# EAGLE design Zio Qwiic Capacitive Touch Sensor AT42QT2120 (EAGLE 9.3.1)
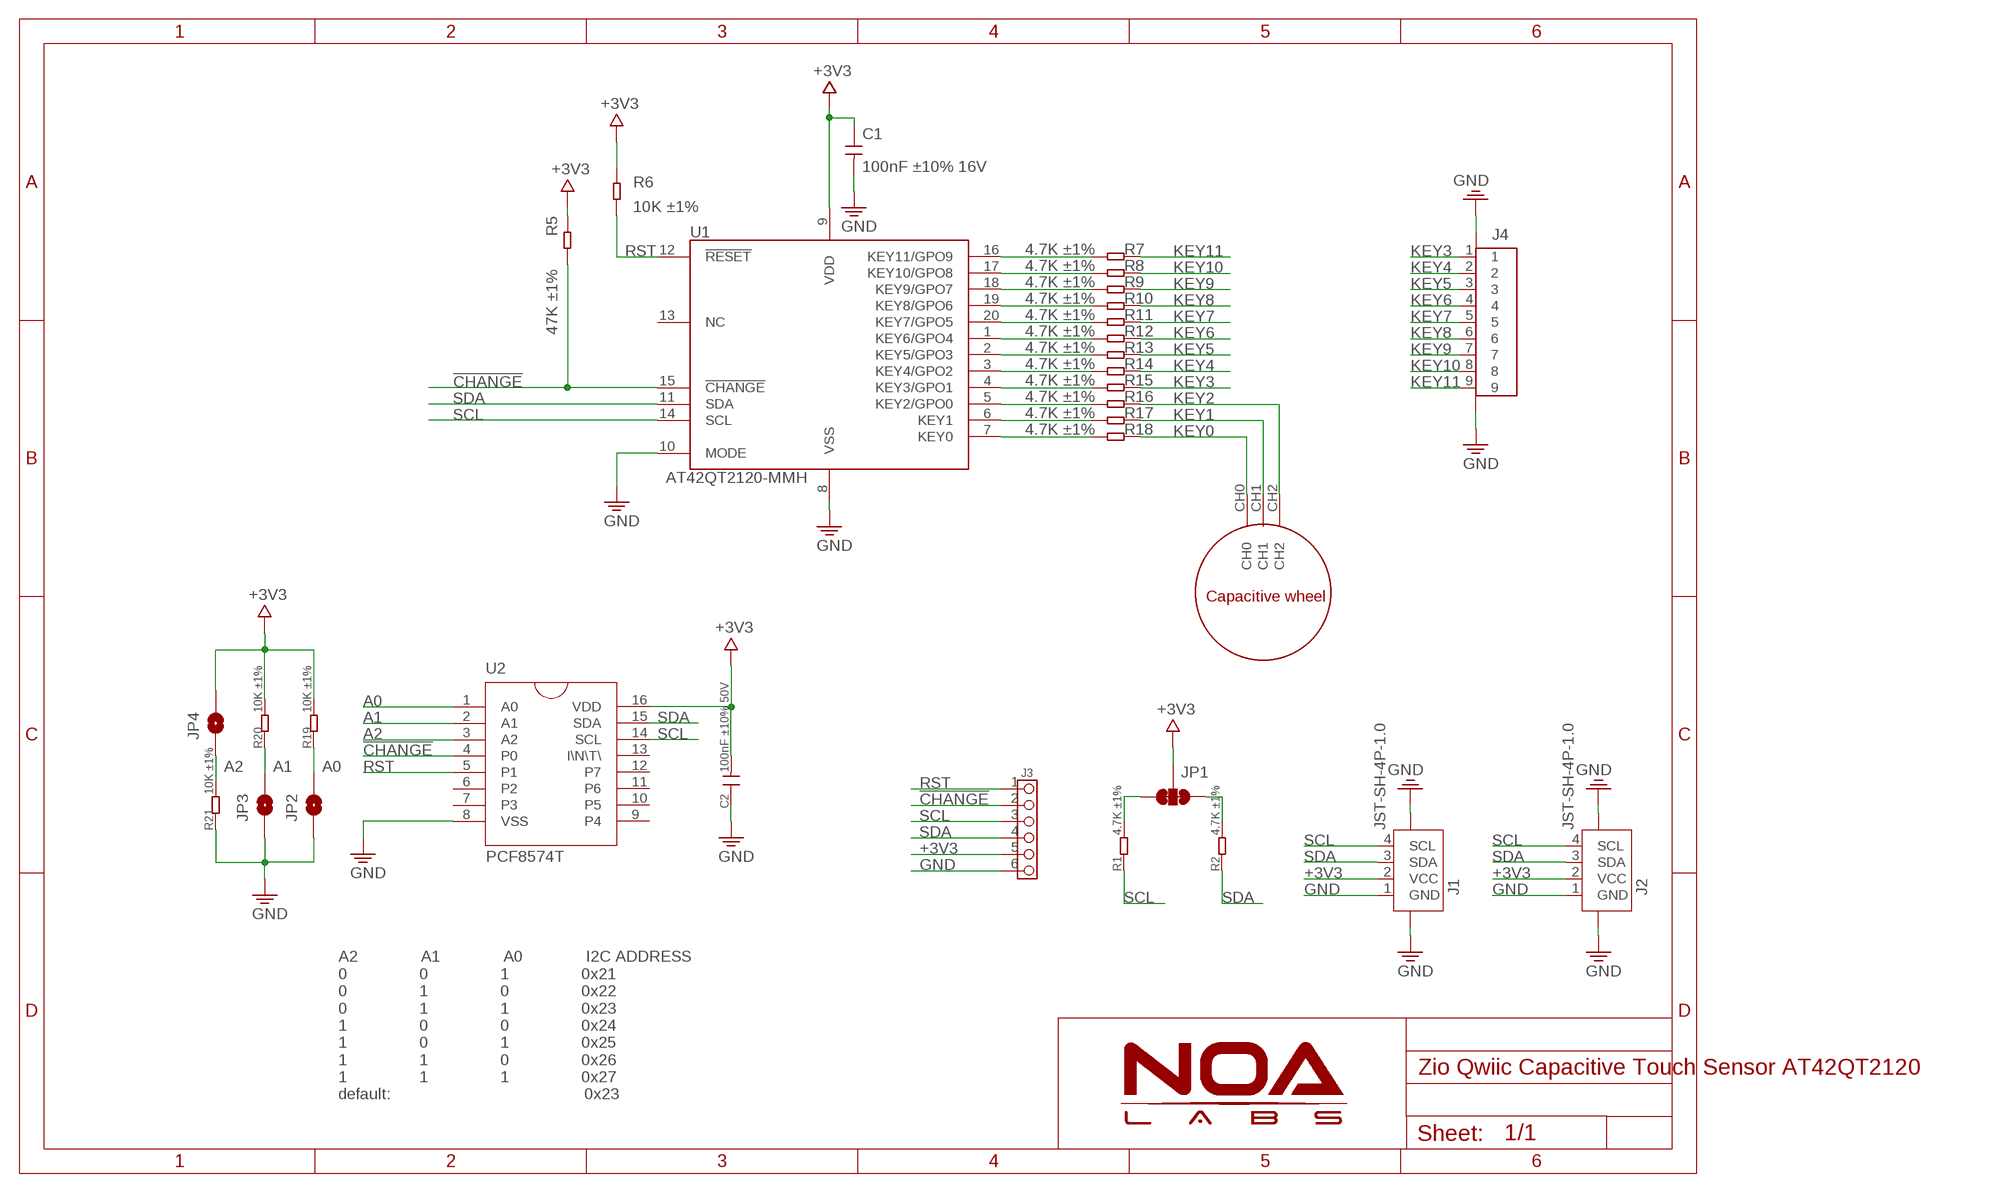
[diagram p0: schematic, sheet 1]

## Parts
C1  100nF ±10% 16V  C-0603  [C0603]
C2  100nF ±10% 50V  C-0603  [C0603]
J1  JST-SH-4P-1.0  [JST-SH-4P]
J2  JST-SH-4P-1.0  [JST-SH-4P]
J3  HEADER-6P-60/35MIL  [6P-2.54-60/35MIL]
J4  FPC-0.5-9P  [FPC-0.5-9P_UP]
JP1  SMT-JUMPER_3_2-NC_TRACE  [SMT-JUMPER_3_2-NC_TRACE]
JP2  JUMPER-SMT_2_NC_PASTE_NOCREM  [SMT-JUMPER_2_NC_PASTE_SILK_NOCREM]
JP3  JUMPER-SMT_2_NC_PASTE_NOCREM  [SMT-JUMPER_2_NC_PASTE_SILK_NOCREM]
JP4  JUMPER-SMT_2_NC_PASTE_NOCREM  [SMT-JUMPER_2_NC_PASTE_SILK_NOCREM]
R1  4.7K ±1%  R-0603  [R0603]
R2  4.7K ±1%  R-0603  [R0603]
R5  47K ±1%  R-0603  [R0603]
R6  10K ±1%  R-0603  [R0603]
R7  4.7K ±1%  R-0402  [R0402]
R8  4.7K ±1%  R-0402  [R0402]
R9  4.7K ±1%  R-0402  [R0402]
R10  4.7K ±1%  R-0402  [R0402]
R11  4.7K ±1%  R-0402  [R0402]
R12  4.7K ±1%  R-0402  [R0402]
R13  4.7K ±1%  R-0402  [R0402]
R14  4.7K ±1%  R-0402  [R0402]
R15  4.7K ±1%  R-0402  [R0402]
R16  4.7K ±1%  R-0402  [R0402]
R17  4.7K ±1%  R-0402  [R0402]
R18  4.7K ±1%  R-0402  [R0402]
R19  10K ±1%  R-0603  [R0603]
R20  10K ±1%  R-0603  [R0603]
R21  10K ±1%  R-0603  [R0603]
U1  AT42QT2120-MMH  AT42QT2120-COMMS-20M2  [QFN45P300X300X85-21N]
U2  PCF8574T  [SO16-W]
U3  QTWHEEL_MODULE  [QTWHEELMODULE]

## Nets
!CHANGE: J3.2 R5.1 U1.15(!CHANGE) U2.4(P0)
+3V3: C1.1 C2.2 J1.2(VCC) J2.2(VCC) J3.5 JP1.2 JP4.2 R5.2 R6.2 R19.2 R20.2 U1.9(VDD) U2.16(VDD)
A0: JP2.2 R19.1 U2.1(A0)
A1: JP3.2 R20.1 U2.2(A1)
A2: JP4.1 R21.2 U2.3(A2)
GND: C1.2 C2.1 J1.1(GND) J1.NC1 J1.NC2 J2.1(GND) J2.NC1 J2.NC2 J3.6 J4.11(G2) JP2.1 JP3.1 R21.1 U1.8(VSS) U1.10(MODE) U2.8(VSS)
KEY0: R18.1 U3.CH0
KEY1: R17.1 U3.CH1
KEY2: R16.1 U3.CH2
KEY3: J4.1 R15.1
KEY4: J4.2 R14.1
KEY5: J4.3 R13.1
KEY6: J4.4 R12.1
KEY7: J4.5 R11.1
KEY8: J4.6 R10.1
KEY9: J4.7 R9.1
KEY10: J4.8 R8.1
KEY11: J4.9 R7.1
N$1: JP1.1 R2.2
N$3: J4.10(G1) ; supply symbol labelled GND
N$6: JP1.3 R1.2
N$199: R7.2 U1.16(KEY11/GPO9)
N$216: R8.2 U1.17(KEY10/GPO8)
N$217: R9.2 U1.18(KEY9/GPO7)
N$218: R10.2 U1.19(KEY8/GPO6)
N$220: R11.2 U1.20(KEY7/GPO5)
N$221: R12.2 U1.1(KEY6/GPO4)
N$222: R13.2 U1.2(KEY5/GPO3)
N$238: R14.2 U1.3(KEY4/GPO2)
N$239: R15.2 U1.4(KEY3/GPO1)
N$240: R16.2 U1.5(KEY2/GPO0)
N$243: R17.2 U1.6(KEY1)
N$250: R18.2 U1.7(KEY0)
RST: J3.1 R6.1 U1.12(!RESET) U2.5(P1)
SCL: J1.4(SCL) J2.4(SCL) J3.3 R1.1 U1.14(SCL) U2.14(SCL)
SDA: J1.3(SDA) J2.3(SDA) J3.4 R2.1 U1.11(SDA) U2.15(SDA)
Unconnected: U1.13(NC) U2.6(P2) U2.7(P3) U2.9(P4) U2.10(P5) U2.11(P6) U2.12(P7) U2.13(I\N\T\)

## Notes on the sheet
- A2              A1              A0              I2C ADDRESS
  0                0                1                0x21
  0                1                0                0x22
  0                1                1                0x23
  1                0                0                0x24
  1                0                1                0x25
  1                1                0                0x26
  1                1                1                0x27
  default:                                           0x23

## Library data of the parts
C1 = RCL:C; VOLTAGE: 25V
C2 = RCL:C
J1 J2 = Connector:JST-SH-4P
J3 = Connector_NOA:HEADER-6P
J4 = Connector:FPC-0.5-9P
JP1 = NOA-Jumpers:SMT-JUMPER_3_2-NC_TRACE
JP2-JP4 = NOA-Jumpers:JUMPER-SMT_2_NC_PASTE_NOCREM
R1 R2 R5-R21 = RCL:R
U1 = IC:AT42QT2120-COMMS: Capacitive Touch Sensors 12 channel AT42QT2120-XU, Spread-Spectrum Charge-Transfer Touch Screen Controller Serial-I2C, 20-Pin TSSOP Source: Datasheet <http://docs-emea.rs-online.com/webdocs/1441/0900766b81441bc2.pdf>
U2 = IC:PCF8574T
U3 = Module:QTWHEEL_MODULE

## Board
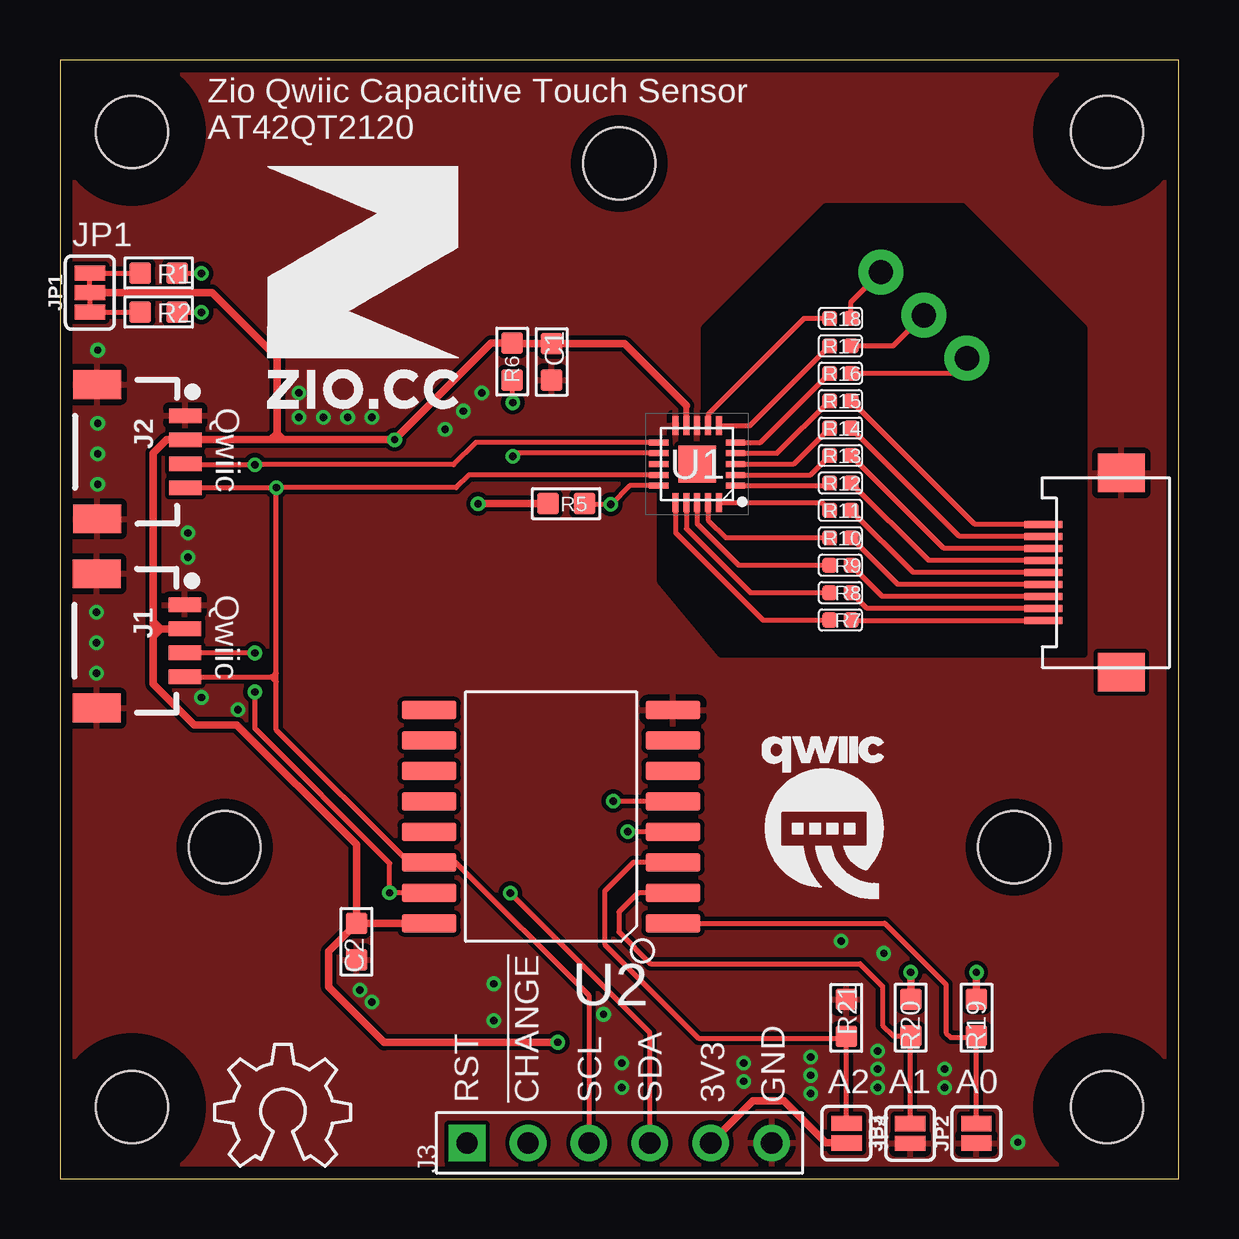
[diagram p1: board, top side]
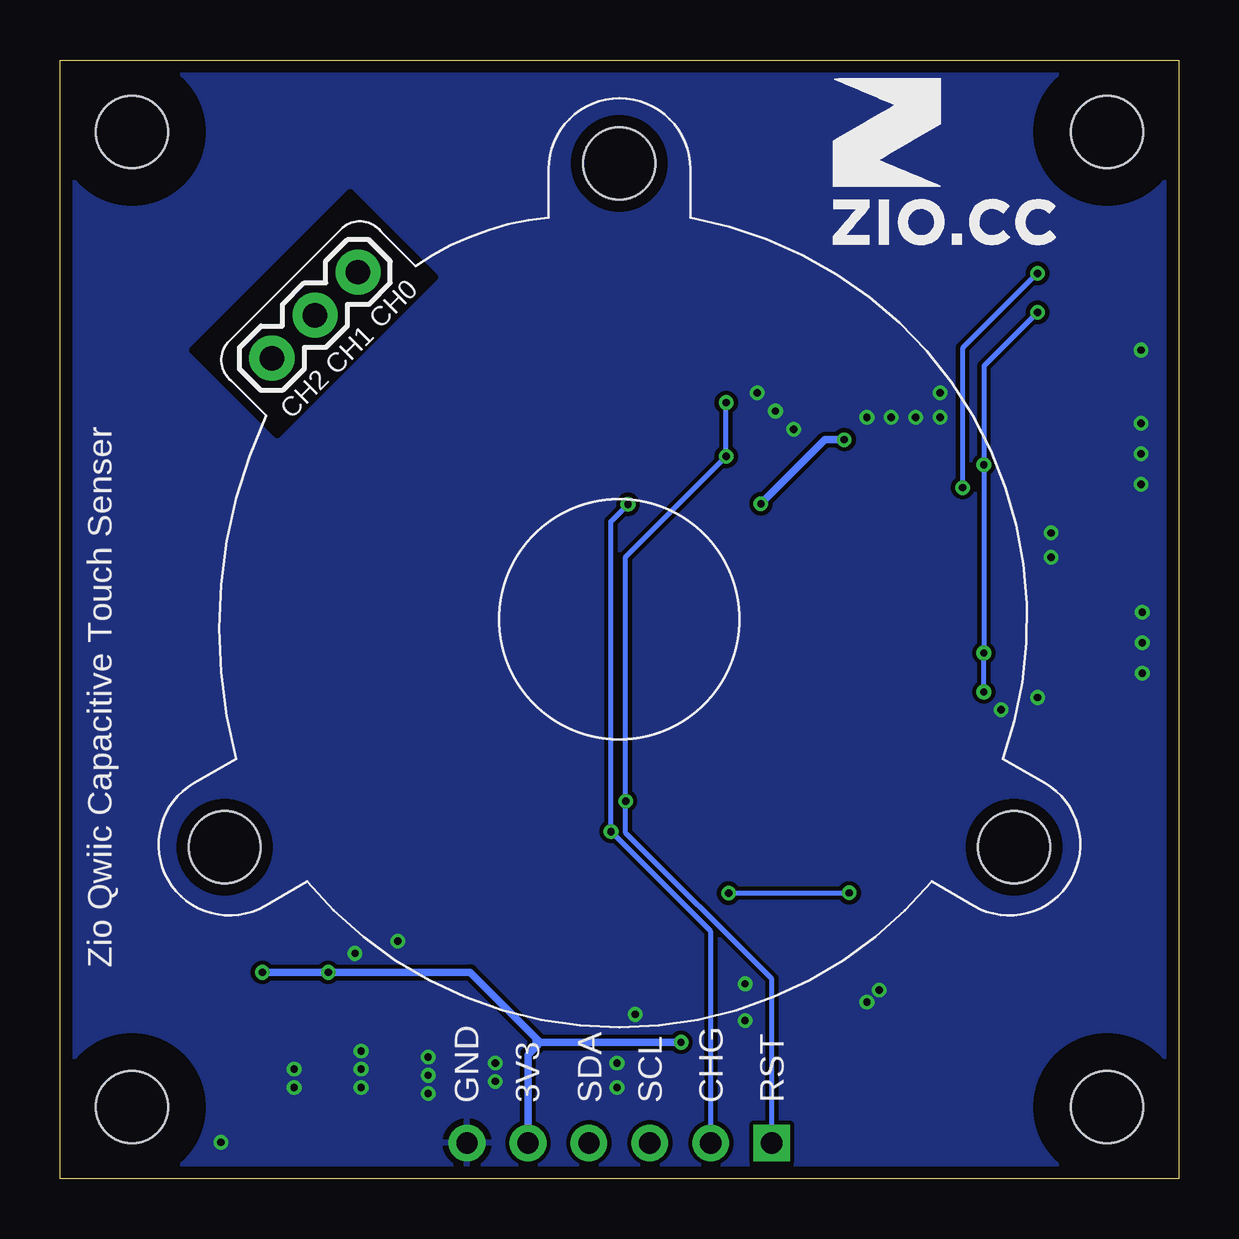
[diagram p2: board, bottom side, seen from below]

Size 46.64 x 46.64 mm. Coordinates in mm from the lower left corner, seen from the top.
Outline: 0,0 46.64,0 46.64,46.64 0,46.64 0,0
Copper layers (1*16): Top 0.035mm / dielectric 1.5mm / Bottom 0.035mm
Design rules "NOA Eagle Rule": minimum track width 7mil, minimum drill 12mil, track to track 7mil, track to pad 7mil, pad to pad 7mil, via to via 7mil, smd to smd 0mil, copper to edge 20mil, drill to drill 10mil, minimum pad ring 10mil, minimum via ring 6mil, stop-mask expansion 2mil, vias tented up to drill 25mil, thermal gap 10mil
Holes 3 mm at 3,3 43.64,3 43.64,43.64 3,43.64
tRestrict: area 0,0 to 6,6; area 40.6,0 to 46.6,6; area 0,40.6 to 6,46.6; area 40.6,40.6 to 46.6,46.6; 9 lines
bRestrict: area 0,40.6 to 6,46.6; area 40.6,40.6 to 46.6,46.6; area 0,0 to 6,6; area 40.6,0 to 46.6,6; 4 lines

### Footprints (pad centres in the part's own frame; a part is rotated, then mirrored left to right if it is on the bottom)
C0603 = smd 0.889 x 0.889: 1 -0.762,0; 2 0.762,0
JST-SH-4P = smd 0.6 x 1.35: 1 1.5,0; 2 0.5,0; 3 -0.5,0; 4 -1.5,0 | smd 1.2 x 2: NC1 -2.8,3.675; NC2 2.8,3.675
6P-2.54-60/35MIL = drill 0.889 pad 1.524 square: 1 0,6.35 | drill 0.889 pad 1.524: 2 0,3.81; 3 0,1.27; 4 0,-1.27; 5 0,-3.81; 6 0,-6.35
FPC-0.5-9P_UP = smd 0.3 x 1.6: 1 -2,-2.59; 2 -1.5,-2.59; 3 -1,-2.59; 4 -0.5,-2.59; 5 0,-2.59; 6 0.5,-2.59; 7 1,-2.59; 8 1.5,-2.59; 9 2,-2.59 | smd 1.6 x 1.95: 10 4.15,0.66; 11 -4.15,0.66
SMT-JUMPER_3_2-NC_TRACE = smd 0.635 x 1.27: 1 -0.813,0; 2 0,0; 3 0.813,0
SMT-JUMPER_2_NC_PASTE_SILK_NOCREM = smd 0.635 x 1.27: 1 -0.406,0; 2 0.406,0
R0603 = smd 0.889 x 0.889: 1 -0.762,0; 2 0.762,0
R0402 = smd 0.635 x 0.635: 1 -0.445,0; 2 0.445,0
QFN45P300X300X85-21N = smd 0.8 x 0.25: 1 -1.6,0.9; 2 -1.6,0.45; 3 -1.6,0; 4 -1.6,-0.45; 5 -1.6,-0.9; 11 1.6,-0.9; 12 1.6,-0.45; 13 1.6,0; 14 1.6,0.45; 15 1.6,0.9 | smd 0.25 x 0.8: 6 -0.9,-1.6; 7 -0.45,-1.6; 8 0,-1.6; 9 0.45,-1.6; 10 0.9,-1.6; 16 0.9,1.6; 17 0.45,1.6; 18 0,1.6; 19 -0.45,1.6; 20 -0.9,1.6 | smd 1.55 x 1.55: 21 0,0
SO16-W = smd 0.762 x 2.286: 1 -4.445,-5.08; 2 -3.175,-5.08; 3 -1.905,-5.08; 4 -0.635,-5.08; 5 0.635,-5.08; 6 1.905,-5.08; 7 3.175,-5.08; 8 4.445,-5.08; 9 4.445,5.08; 10 3.175,5.08; 11 1.905,5.08; 12 0.635,5.08; 13 -0.635,5.08; 14 -1.905,5.08; 15 -3.175,5.08; 16 -4.445,5.08
QTWHEELMODULE = drill 1.016 pad 1.88: CH0 10.897,-14.478; CH1 12.693,-12.682; CH2 14.489,-10.886 | hole 3: 16.454,9.5; -16.454,9.5; 0,-19

### Placement (x,y rotation side)
C1  20.49,34.05 270 top
C2  12.36,9.88 90 top
J1  5.2,22.42 90 top
J2  5.23,30.31 90 top
J3  23.32,1.5 90 top
J4  43.58,25.28 270 top
JP1  1.24,36.94 90 top
JP2  38.2,1.9 90 top
JP3  35.44,1.9 90 top
JP4  32.78,1.91 270 top
R1  4.11,37.76 180 top
R2  4.11,36.13 180 top
R5  21.1,28.15 180 top
R6  18.85,34.07 90 top
R7  32.53,23.3 180 top
R8  32.53,24.44 180 top
R9  32.53,25.58 180 top
R10  32.53,26.72 180 top
R11  32.53,27.87 180 top
R12  32.53,29.01 180 top
R13  32.53,30.15 180 top
R14  32.53,31.3 180 top
R15  32.53,32.44 180 top
R16  32.53,33.58 180 top
R17  32.53,34.73 180 top
R18  32.53,35.87 180 top
R19  38.2,6.72 90 top
R20  35.46,6.72 90 top
R21  32.78,6.71 270 top
U1  26.56,29.8 180 top
U2  20.47,15.1 90 top
U3  23.32,23.32 180 bottom
U$1  [7MM]  14.43,38.96 0 bottom
U$2  [10MM]  8.64,32.13 0 top
U$3  [OSHW_6X200_NOTEXT]  6.45,0.53 0 top
U$4  [QWIIC-LOGO-MEDIUM]  31.8,15.11 0 top

### Tracks (layer width: path | path; a pad name or v marks a point on that pad's centre or on a via)
!CHANGE  (via drill 0.3)
  Top 0.203: R5.1 21.87,28.16 21.92,28.12 v22.96,28.12 23.74,28.9 U1.15 | U2.4 23.69,14.46 v23.67,14.48
  Bottom 0.203: J3.2 19.51,10.31 v23.67,14.48 23.67,27.41 v22.96,28.12
+3V3  (via drill 0.3)
  Top 0.254: U1.9 26.11,32.23
  Top 0.305: 3.89,23.24 3.89,30.25 4.45,30.81 J2.2 8.79,30.81 | 3.89,23.24 3.89,22.61 | 3.89,22.61 3.89,20.62 5.59,18.92 7.37,18.92 12.36,13.93 C2.2 | 8.79,30.81 9.3,30.81 | 9.3,30.81 v13.95,30.81 17.96,34.83 R6.2 18.86,34.82 C1.1 23.53,34.82 26.11,32.23 | R19.2 v38.2,8.61 | v35.46,8.61 R20.2 | C2.2 15.38,10.64 U2.16 | J1.2 4.2,22.92 | 4.2,22.92 3.89,23.24 | 4.2,22.92 3.89,22.61 | v20.75,5.69 13.51,5.69 11.2,8 11.2,9.49 C2.2 | JP4.2 31.93,1.5 30.18,3.25 28.88,3.25 J3.5 | R5.2 v17.43,28.15 v17.42,28.14 | JP1.2 6.34,36.95 9.04,34.24 9.04,31.07 | 9.04,31.07 8.79,30.81 | 9.04,31.07 9.3,30.81
  Bottom 0.305: v38.2,8.61 v35.46,8.61 29.54,8.61 26.8,5.87 | 26.62,5.69 v20.75,5.69 | 26.8,5.87 26.62,5.69 | J3.5 27.13,5.18 26.8,5.51 | 26.8,5.51 26.62,5.69 | 26.8,5.51 26.8,5.87 | v17.42,28.14 14.75,30.81 v13.95,30.81
A0
  Top 0.203: JP2.2 38.2,5.89 | 38.2,5.89 R19.1 | U2.1 34.38,10.65 36.93,8.1 36.93,6.1 37.13,5.89 38.2,5.89
A1
  Top 0.203: JP3.2 35.44,5.94 R20.1 34.73,5.96 34.29,6.4 34.29,8.03 33.35,8.97 24.61,8.97 23.29,10.29 23.29,11.12 24.09,11.93 U2.2
A2
  Top 0.203: JP4.1 32.78,5.87 | 32.78,5.87 R21.2 | U2.3 23.91,13.2 22.71,11.99 22.71,9.78 26.62,5.87 32.78,5.87
GND  (via drill 0.3)
  other vias: 1.52,23.62 1.52,22.35 1.52,21.08 5.33,25.91 5.33,26.92 16.05,31.24 16.81,32 17.58,32.77 9.96,31.75 10.97,31.75 9.96,32.77 11.99,31.75 13,31.75 1.57,28.96 1.57,30.23 1.57,31.5 18.08,8.13 18.08,6.6 22.66,6.86 23.42,4.83 23.42,3.81 34.09,5.33 34.09,4.57 34.09,3.81 36.88,3.81 36.88,4.57 39.93,1.52 28.5,4.06 28.5,4.83 31.29,3.56 31.29,4.32 31.29,5.08 34.34,9.4 32.56,9.91 5.89,20.07 7.42,19.56 12.5,7.87 13,7.37 1.57,34.54
  pour Bottom: 0,46.63 46.63,46.63 46.63,0 0,0
  pour Top: 0,46.63 46.63,46.63 46.63,0 0,0
KEY0
  Top 0.203: R18.1 32.98,36.56 U3.CH0
KEY1
  Top 0.203: R17.1 34.74,34.73 U3.CH1
KEY2
  Top 0.203: R16.1 37.19,33.58 U3.CH2
KEY3
  Top 0.203: J4.1 38.14,27.28 R15.1
KEY4
  Top 0.203: J4.2 37.49,26.78 R14.1
KEY5
  Top 0.203: J4.3 36.85,26.28 R13.1
KEY6
  Top 0.203: J4.4 36.21,25.78 R12.1
KEY7
  Top 0.203: J4.5 35.57,25.28 R11.1
KEY8
  Top 0.203: J4.6 34.92,24.78 R10.1
KEY9
  Top 0.203: J4.7 34.28,24.28 R9.1
KEY10
  Top 0.203: J4.8 33.64,23.78 R8.1
KEY11
  Top 0.203: R7.1 32.99,23.28 J4.9
N$1
  Top 0.203: JP1.1 R2.2
N$6
  Top 0.203: JP1.3 R1.2
N$199
  Top 0.203: U1.16 25.66,26.94 29.3,23.3 R7.2
N$216
  Top 0.203: U1.17 26.11,27.1 28.78,24.44 R8.2
N$217
  Top 0.203: U1.18 26.56,27.31 28.29,25.58 R9.2
N$218
  Top 0.203: U1.19 27.01,27.47 27.75,26.72 R10.2
N$220
  Top 0.203: U1.20 31.76,28.2 R11.2
N$221
  Top 0.203: U1.1 31.97,28.9 R12.2
N$222
  Top 0.203: U1.2 31.28,29.35 R13.2
N$238
  Top 0.203: U1.3 30.59,29.8 R14.2
N$239
  Top 0.203: U1.4 29.89,30.25 R15.2
N$240
  Top 0.203: U1.5 29.2,30.7 R16.2
N$243
  Top 0.203: U1.6 28.76,31.4 R17.2
N$250
  Top 0.203: R18.2 31.01,35.87 27.01,31.87 U1.7
RST  (via drill 0.3)
  Top 0.203: U1.12 19.01,30.25 v18.87,30.11 | v18.87,32.36 18.87,33.28 R6.1 | U2.5 23.08,15.73 v23.06,15.75
  Bottom 0.203: v18.87,32.36 v18.87,30.11 23.06,25.92 v23.06,15.75 23.06,14.43 16.97,8.33 J3.1
SCL  (via drill 0.3)
  Top 0.203: 9.17,28.81 16.52,28.81 17.05,29.35 U1.14 | 9.17,28.81 v9.02,28.81 | J2.4 8.83,28.81 | 8.83,28.81 v9.02,28.81 | 9.02,20.73 9.02,18.72 14.54,13.2 U2.14 16.5,13.2 22.05,7.64 J3.3 | 9.02,20.73 9.02,21.08 | 9.02,21.08 9.02,28.63 | 9.02,28.63 v9.02,28.81 | 9.02,28.63 8.83,28.81 | 9.02,28.63 9.17,28.78 9.17,28.81 | 8.82,20.92 9.02,20.73 | J1.4 8.82,20.92 | 8.82,20.92 8.86,20.92 9.02,21.08 | R1.1 5.88,37.76 v5.89,37.74
  Bottom 0.203: v5.89,37.74 9.02,34.62 v9.02,28.81
SDA  (via drill 0.3)
  Top 0.203: U1.11 17.34,30.7 16.41,29.77 v8.13,29.77 5.27,29.77 J2.3 | v8.13,21.92 J1.3 | U2.15 v13.74,11.93 13.74,13.16 8.13,18.77 v8.13,20.3 | J3.4 24.59,6.09 v18.77,11.91 | R2.1 5.88,36.13 v5.89,36.12
  Bottom 0.203: v8.13,20.3 v8.13,21.92 v8.13,29.77 8.13,33.88 v5.89,36.12 | v18.77,11.91 13.75,11.91 v13.74,11.93

### Text on the board
tPlace: Zio Qwiic Capacitive Touch Sensor / AT42QT2120 | JP1 | Qwiic | Qwiic | A2 | A1 | A0 | RST | !CHANGE | SCL | SDA | 3V3 | GND
bPlace: Zio Qwiic Capacitive Touch Senser | RST | CHG | SCL | SDA | 3V3 | GND